# EAGLE schematic MCPv4_eingabe (EAGLE 9.6.2)
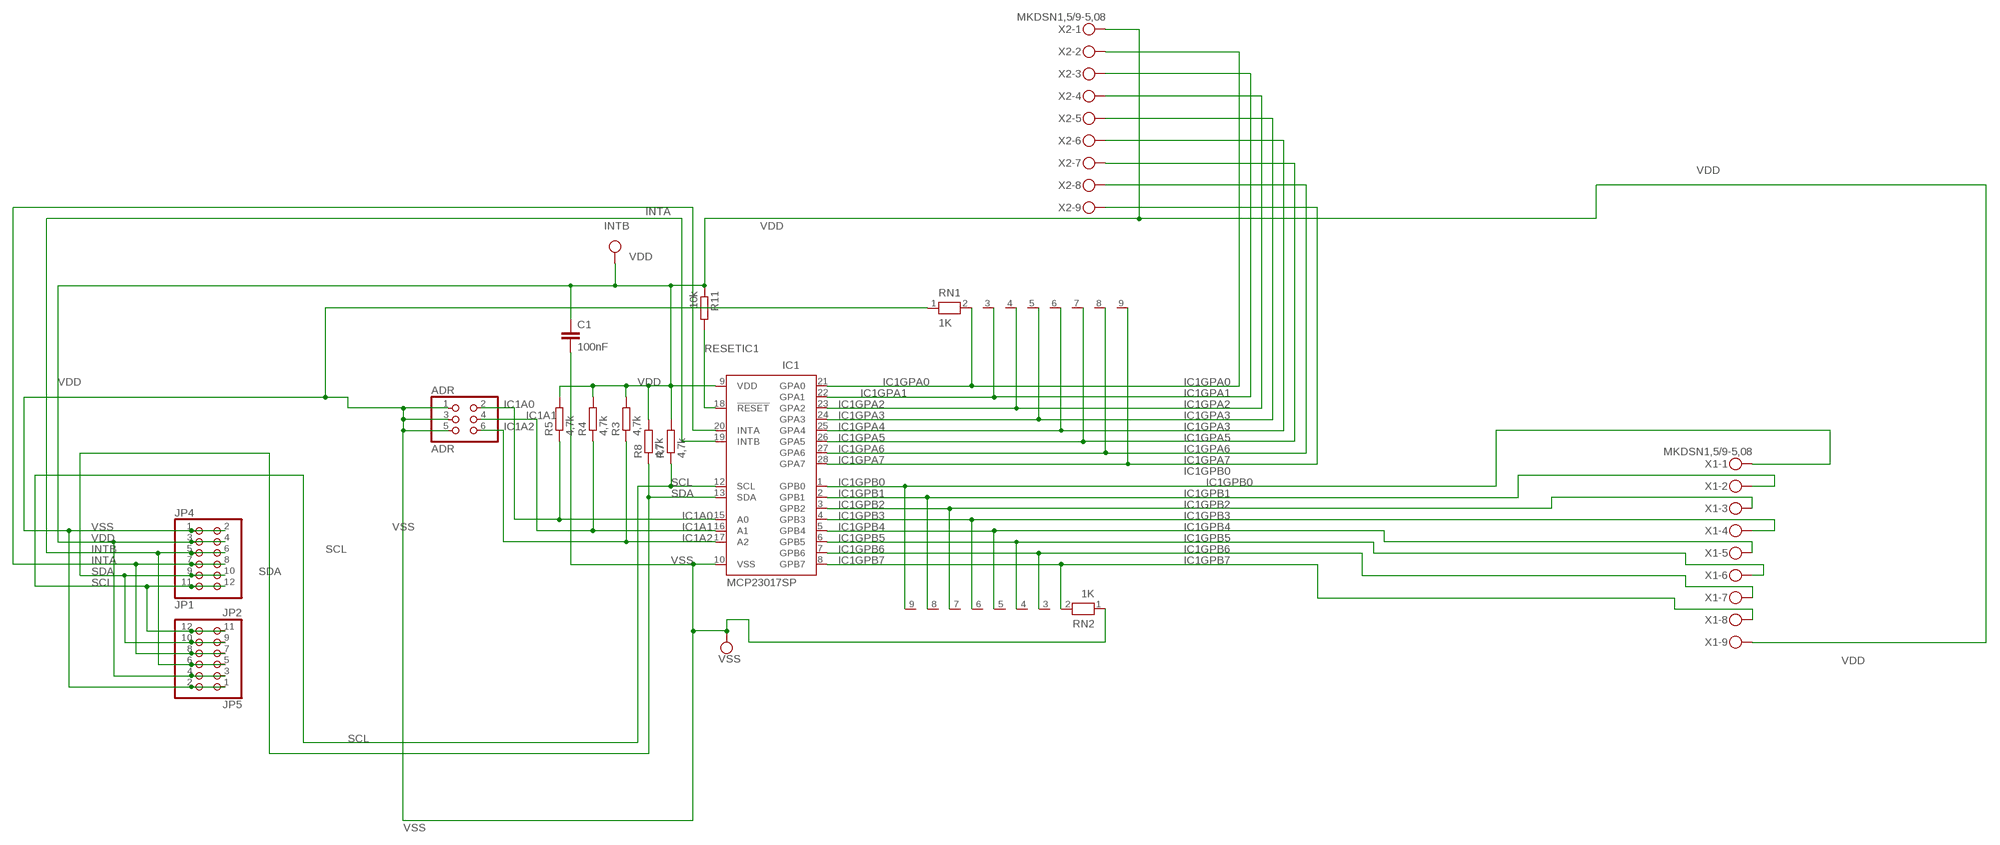
[diagram p0: schematic, sheet 1]

## Parts
ADR  ADR  PINHD-2X3  [2X03]
C1  100nF  C-EU025_050-025X075  [C025_050-025X075]
IC1  MCP23017SP  [DIL28-3]
JP4  JP1  PINHD-2X6/90  [2X06/90]
JP5  JP2  PINHD-2X6/90  [2X06/90]
R3  4,7k  R-EU_0204/7  [0204/7]
R4  4,7k  R-EU_0204/7  [0204/7]
R5  4,7k  R-EU_0204/7  [0204/7]
R7  4,7k  R-EU_0204/7  [0204/7]
R8  4,7k  R-EU_0204/7  [0204/7]
R11  10k  R-EU_0204/7  [0204/7]
RN1  1K  RN08  [RN-9]
RN2  1K  RN08  [RN-9]
X1  MKDSN1,5/9-5,08  [MKDSN1,5/9-5,08]
X2  MKDSN1,5/9-5,08  [MKDSN1,5/9-5,08]

## Nets
IC1A0: ADR.2 IC1.15(A0) R5.1
IC1A1: ADR.4 IC1.16(A1) R4.1
IC1A2: ADR.6 IC1.17(A2) R3.1
IC1GPA0: IC1.21(GPA0) RN1.2 X2.2
IC1GPA1: IC1.22(GPA1) RN1.3 X2.3
IC1GPA2: IC1.23(GPA2) RN1.4 X2.4
IC1GPA3: IC1.24(GPA3) RN1.5 X2.5
IC1GPA4: IC1.25(GPA4) RN1.6 X2.6
IC1GPA5: IC1.26(GPA5) RN1.7 X2.7
IC1GPA6: IC1.27(GPA6) RN1.8 X2.8
IC1GPA7: IC1.28(GPA7) RN1.9 X2.9
IC1GPB0: IC1.1(GPB0) RN2.9 X1.1
IC1GPB1: IC1.2(GPB1) RN2.8 X1.2
IC1GPB2: IC1.3(GPB2) RN2.7 X1.3
IC1GPB3: IC1.4(GPB3) RN2.6 X1.4
IC1GPB4: IC1.5(GPB4) RN2.5 X1.5
IC1GPB5: IC1.6(GPB5) RN2.4 X1.6
IC1GPB6: IC1.7(GPB6) RN2.3 X1.7
IC1GPB7: IC1.8(GPB7) RN2.2 X1.8
INTA: IC1.20(INTA) JP4.7 JP4.8 JP5.7 JP5.8
INTB: IC1.19(INTB) JP4.5 JP4.6 JP5.5 JP5.6
RESETIC1: IC1.18(!RESET) R11.2
SCL: IC1.12(SCL) JP4.11 JP4.12 JP5.11 JP5.12 R7.1
SDA: IC1.13(SDA) JP4.9 JP4.10 JP5.9 JP5.10 R8.1
VDD: C1.1 IC1.9(VDD) JP4.3 JP4.4 JP5.3 JP5.4 R3.2 R4.2 R5.2 R7.2 R8.2 R11.1 X1.9 X2.1
VSS: ADR.1 ADR.3 ADR.5 C1.2 IC1.10(VSS) JP4.1 JP4.2 JP5.1 JP5.2 RN1.1 RN2.1

## Library data of the parts
ADR = pinhead:PINHD-2X3: PIN HEADER
C1 = resistor:C-EU: CAPACITOR, European symbol
IC1 = microchip:MCP23017: http://ww1.microchip.com/downloads/en/DeviceDoc/21952a.pdf Source: http://ww1.microchip.com/downloads/en/DeviceDoc/21952a.pdf; MF: MICROCHIP; MPN: MCP23017-E/SP; OC_FARNELL: 1332088; OC_NEWARK: 31K2959
JP4 JP5 = pinhead:PINHD-2X6: PIN HEADER
R3-R5 R7 R8 R11 = resistor:R-EU_: RESISTOR, European symbol
RN1 RN2 = resistor-net:RN08: RESISTOR NETWORK; OC_FARNELL: unknown; OC_NEWARK: unknown
X1 X2 = con-phoenix-508:MKDSN1,5/9-5,08: MKDSN 1,5/ 9-5,08 Printklemme Nennstrom: 13,5 A Nennspannung: 250 V Rastermaß: 5,08 mm Polzahl: 9 Anschlussart: Schraubanschluss Montage: Löten Anschlussrichtung Leiter/Platine: 0 ° Artikelnummer: 1729199 Source: http://eshop.phoenixcontact.com .. 1729199.pdf